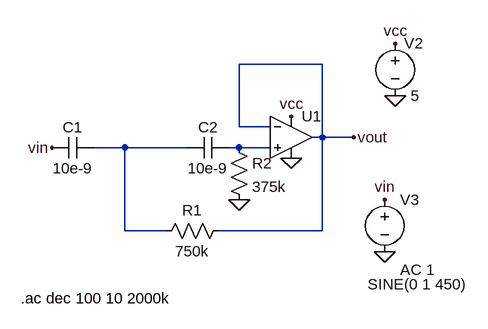
[diagram p0: schematic hpf_freq_analysis.asc]
hpf_freq_analysis.asc, the LTspice schematic file:
Version 4
SHEET 1 880 680
WIRE 304 48 176 48
WIRE 176 144 176 48
WIRE 224 144 176 144
WIRE 304 160 304 48
WIRE 304 160 288 160
WIRE 352 160 304 160
WIRE 0 176 -48 176
WIRE 96 176 0 176
WIRE 176 176 160 176
WIRE 224 176 176 176
WIRE 0 304 0 176
WIRE 64 304 0 304
WIRE 304 304 304 160
WIRE 304 304 144 304
FLAG 176 256 0
FLAG 416 96 0
FLAG 416 16 vcc
FLAG 256 128 vcc
FLAG 256 192 0
FLAG 400 336 0
FLAG 400 256 vin
FLAG -112 176 vin
FLAG 352 160 vout
SYMBOL cap -48 160 R90
WINDOW 0 0 32 VBottom 2
WINDOW 3 32 32 VTop 2
SYMATTR InstName C1
SYMATTR Value 10e-9
SYMBOL cap 160 160 R90
WINDOW 0 0 32 VBottom 2
WINDOW 3 32 32 VTop 2
SYMATTR InstName C2
SYMATTR Value 10e-9
SYMBOL OpAmps\\UniversalOpAmp 256 160 R0
SYMATTR InstName U1
SYMBOL res 160 160 R0
SYMATTR InstName R2
SYMATTR Value 375k
SYMBOL res 160 288 R90
WINDOW 0 0 56 VBottom 2
WINDOW 3 32 56 VTop 2
SYMATTR InstName R1
SYMATTR Value 750k
SYMBOL voltage 416 0 R0
WINDOW 0 14 15 Left 2
WINDOW 123 0 0 Left 0
WINDOW 39 0 0 Left 0
SYMATTR InstName V2
SYMATTR Value 5
SYMBOL voltage 400 240 R0
WINDOW 3 -26 146 Left 2
WINDOW 123 24 124 Left 2
WINDOW 39 0 0 Left 0
SYMATTR InstName V3
SYMATTR Value SINE(0 1 450)
SYMATTR Value2 AC 1
TEXT -160 408 Left 2 !.ac dec 100 10 2000k

The netlist it stands for:
* hpf_freq_analysis.asc
C1 N001 vin 10e-9
C2 N002 N001 10e-9
XU1 N002 vout vcc 0 vout level1 Avol=1Meg GBW=10Meg Vos=0 En=0 Enk=0 In=0 Ink=0 Rin=500Meg  ; pins In+ In- V+ V- OUT
R2 N002 0 375k
R1 vout N001 750k
V2 vcc 0 5
V3 vin 0 SINE(0 1 450) AC 1
.ac dec 100 10 2000k
.lib UniversalOpAmp1.lib
.backanno
.end